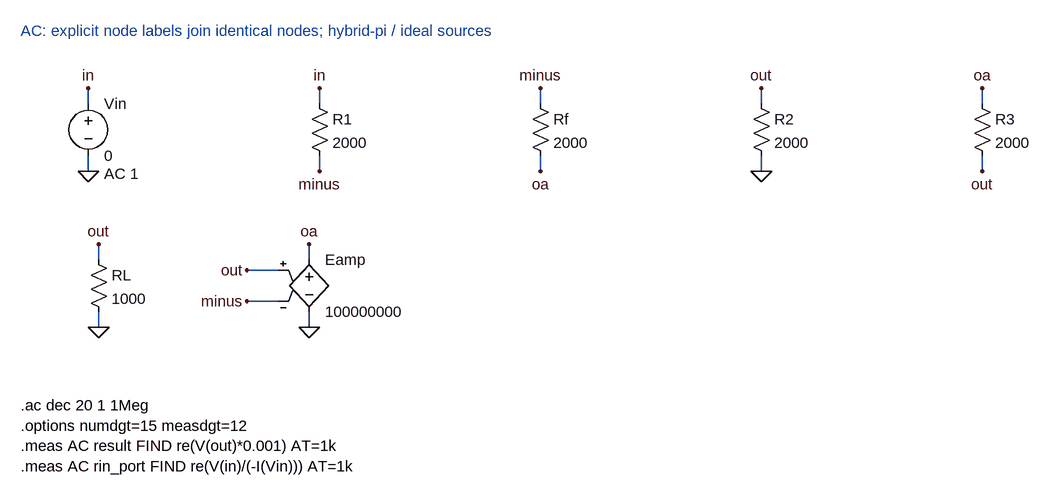
[diagram p0: schematic AC.asc]
AC.asc, the LTspice schematic file:
Version 4
SHEET 1 1800 1500
TEXT 16 -48 Left 2 ;AC: explicit node labels join identical nodes; hybrid-pi / ideal sources
WIRE 120 64 120 40
FLAG 120 40 in
WIRE 120 144 120 168
FLAG 120 168 0
SYMBOL voltage 120 48 R0
SYMATTR InstName Vin
WINDOW 123 24 124 Left 2
SYMATTR Value 0
SYMATTR Value2 AC 1
WIRE 476 64 476 40
FLAG 476 40 in
WIRE 476 144 476 168
FLAG 476 168 minus
SYMBOL res 460 48 R0
SYMATTR InstName R1
SYMATTR Value 2000
WIRE 816 64 816 40
FLAG 816 40 minus
WIRE 816 144 816 168
FLAG 816 168 oa
SYMBOL res 800 48 R0
SYMATTR InstName Rf
SYMATTR Value 2000
WIRE 1156 64 1156 40
FLAG 1156 40 out
WIRE 1156 144 1156 168
FLAG 1156 168 0
SYMBOL res 1140 48 R0
SYMATTR InstName R2
SYMATTR Value 2000
WIRE 1496 64 1496 40
FLAG 1496 40 oa
WIRE 1496 144 1496 168
FLAG 1496 168 out
SYMBOL res 1480 48 R0
SYMATTR InstName R3
SYMATTR Value 2000
WIRE 136 304 136 280
FLAG 136 280 out
WIRE 136 384 136 408
FLAG 136 408 0
SYMBOL res 120 288 R0
SYMATTR InstName RL
SYMATTR Value 1000
WIRE 460 304 460 280
FLAG 460 280 oa
WIRE 460 384 460 408
FLAG 460 408 0
WIRE 412 320 364 320
FLAG 364 320 out
WIRE 412 368 364 368
FLAG 364 368 minus
SYMBOL e 460 288 R0
SYMATTR InstName Eamp
SYMATTR Value 100000000
TEXT 16 528 Left 2 !.ac dec 20 1 1Meg\n.options numdgt=15 measdgt=12\n.meas AC result FIND re(V(out)*0.001) AT=1k\n.meas AC rin_port FIND re(V(in)/(-I(Vin))) AT=1k

The netlist it stands for:
* AC.asc
Vin in 0 0 AC 1
R1 in minus 2000
Rf minus oa 2000
R2 out 0 2000
R3 oa out 2000
RL out 0 1000
Eamp oa 0 out minus 100000000
* AC: explicit node labels join identical nodes; hybrid-pi / ideal sources
.ac dec 20 1 1Meg
.options numdgt=15 measdgt=12
.meas AC result FIND re(V(out)*0.001) AT=1k
.meas AC rin_port FIND re(V(in)/(-I(Vin))) AT=1k
.backanno
.end

* Results of the author's LTspice run, read from the files saved beside the schematic
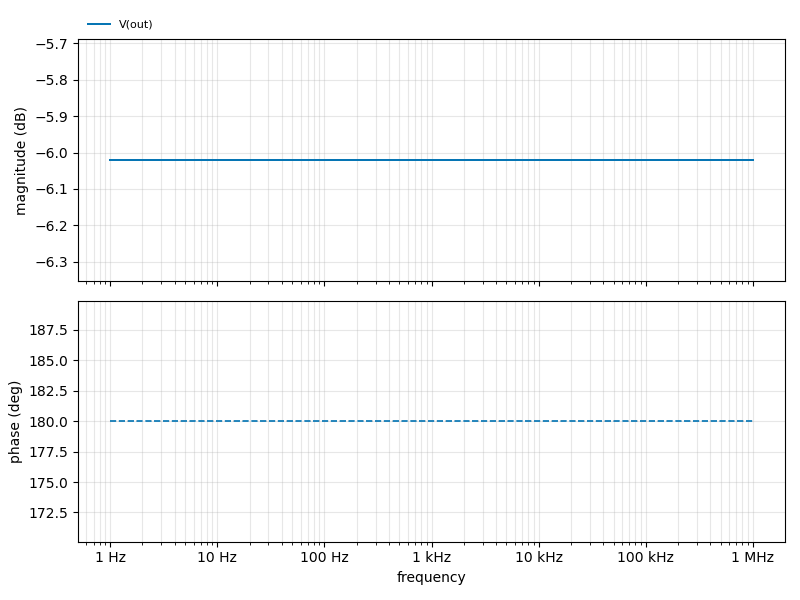
[diagram p1: AC Analysis of AC.asc, plotted from the saved traces]
* AC Analysis, 1 run:
*   V(out): -6.02 dB at 1 Hz, -6.02 dB at 1 MHz, peak -6.02 dB at 1 Hz
* From the log:
*   result: re(V(out)*0.001)=(-66.0206002312dB,180°) at 1000
*   rin_port: re(V(in)/(-I(Vin)))=(62.4987749539dB,0°) at 1000